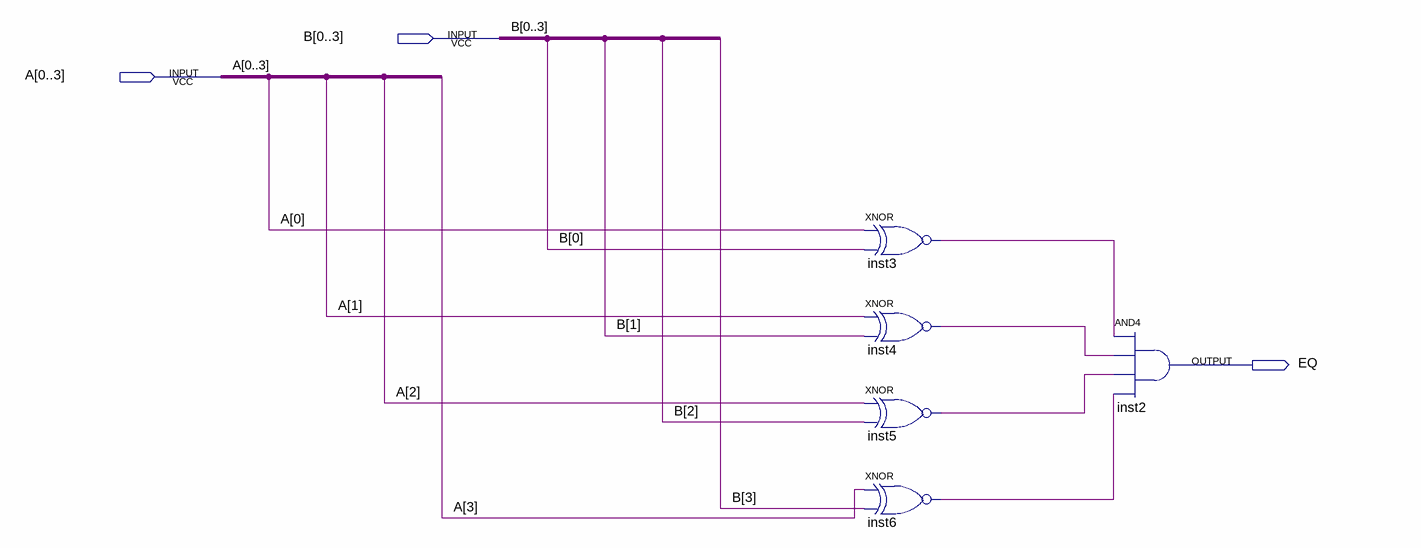
[diagram p0: schematic sheet]
// Quartus schematic ComparatorFourBit.bdf as structural Verilog: 5 symbols, 3 pins
module ComparatorFourBit (
  input  [0:3] B,
  input  [0:3] A,
  output EQ
);

  wire inst3_out, inst4_out, inst5_out, inst6_out;

  xnor inst3 (inst3_out, A[0], B[0]);
  xnor inst4 (inst4_out, A[1], B[1]);
  xnor inst5 (inst5_out, A[2], B[2]);
  xnor inst6 (inst6_out, A[3], B[3]);
  and inst2 (EQ, inst3_out, inst4_out, inst5_out, inst6_out);
endmodule
